# EAGLE design teensy_cfd (EAGLE 9.6.2)
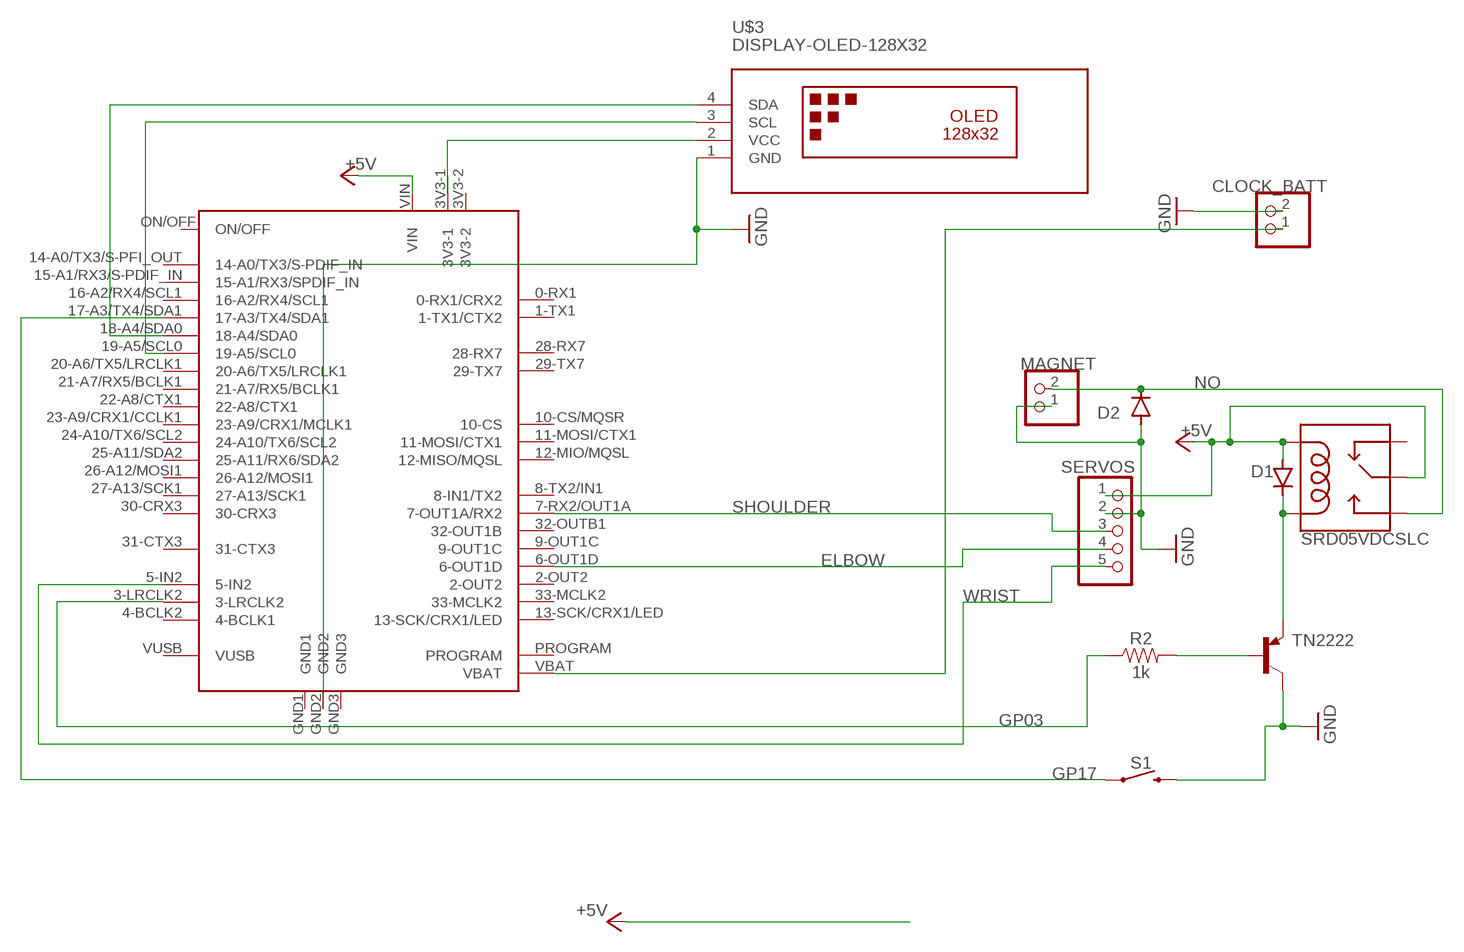
[diagram p0: schematic, sheet 1]

## Parts
CLOCK_BATT  PINHD-1X2  [1X02]
D1  1N4004  [DO41-10]
D2  1N4004  [DO41-10]
MAGNET  PINHD-1X2  [1X02]
R2  1k  1KOHM-HORIZ-1/4W-1%  [AXIAL-0.3]
S1  MOMENTARY-SWITCH-SPST-PTH-6.0MM  [TACTILE_SWITCH_PTH_6.0MM]
SERVOS  PINHD-1X5  [1X05]
SRD05VDCSLC  RELAYPTH  [SRD-05VDC-SL-C]
TN2222  TN2222  PNP_TO92  [TO92]
U$1  TEENSY40  [TEENSY40]
U$3  DISPLAY-OLED-128X32  [DISPLAY-OLED-128X32]

## Nets
+5V: D1.A SERVOS.1 SRD05VDCSLC.COIL1 SRD05VDCSLC.SWCOMMON U$1.VIN
ELBOW: SERVOS.4 U$1.6-OUT1D
GND: CLOCK_BATT.2 D2.A MAGNET.1 S1.3 SERVOS.2 TN2222.1(C) U$1.GND2 U$3.1(GND)
GP03: R2.P$1 U$1.3-LRCLK2
GP17: S1.1 U$1.17-A3/TX4/SDA1
N$1: R2.P$2 TN2222.2(B)
N$2: D1.C SRD05VDCSLC.COIL0 TN2222.3(E)
N$3: CLOCK_BATT.1 U$1.VBAT
N$5: U$1.18-A4/SDA0 U$3.4(SDA)
N$6: U$1.19-A5/SCL0 U$3.3(SCL)
N$7: U$1.3V3-1 U$3.2(VCC)
NO: D2.C MAGNET.2 SRD05VDCSLC.SWOPEN
SHOULDER: SERVOS.3 U$1.7-RX2/OUT1A(7-OUT1A/RX2)
WRIST: SERVOS.5 U$1.5-IN2
Unconnected: SRD05VDCSLC.SWCLOSED(SWCLOSE) U$1.0-RX1(0-RX1/CRX2) U$1.1-TX1(1-TX1/CTX2) U$1.2-OUT2 U$1.3V3-2 U$1.4-BCLK2(4-BCLK1) U$1.8-TX2/IN1(8-IN1/TX2) U$1.9-OUT1C U$1.10-CS/MQSR(10-CS) U$1.11-MOSI/CTX1 U$1.12-MIO/MQSL(12-MISO/MQSL) U$1.13-SCK/CRX1/LED U$1.14-A0/TX3/S-PFI_OUT(14-A0/TX3/S-PDIF_IN) U$1.15-A1/RX3/S-PDIF_IN(15-A1/RX3/SPDIF_IN) U$1.16-A2/RX4/SCL1 U$1.20-A6/TX5/LRCLK1 U$1.21-A7/RX5/BCLK1 U$1.22-A8/CTX1 U$1.23-A9/CRX1/CCLK1(23-A9/CRX1/MCLK1) U$1.24-A10/TX6/SCL2 U$1.25-A11/SDA2(25-A11/RX6/SDA2) U$1.26-A12/MOSI1 U$1.27-A13/SCK1 U$1.28-RX7 U$1.29-TX7 U$1.30-CRX3 U$1.31-CTX3 U$1.32-OUTB1(32-OUT1B) U$1.33-MCLK2 U$1.GND1 U$1.GND3 U$1.ON/OFF U$1.PROGRAM U$1.VUSB

## Library data of the parts
CLOCK_BATT MAGNET = pinhead:PINHD-1X2: PIN HEADER
D1 D2 = diode:1N4004: DIODE general purpose rectifier, 1 A
R2 = SparkFun-Resistors:1KOHM: 1kΩ resistor A resistor is a passive two-terminal electrical component that implements electrical resistance as a circuit element. Resistors act to reduce current flow, and, at the same time, act to lower voltage levels within circuits. - Wikipedia; PROD_ID: RES-12182
S1 = SparkFun-Switches:MOMENTARY-SWITCH-SPST: Momentary Switch (Pushbutton) - SPST Normally-open (NO) SPST momentary switches (buttons, pushbuttons). Variants PTH-12MM - 12mm square, through-hole Momentary Pushbutton Switch - 12mm Square <https://www.sparkfun.com/products/9190> (COM-09190) PTH-6.0MM, PTH-6.0MM-KIT - 6.0mm square, through-hole Mini Pushbutton Switch <https://www.sparkfun.com/products/97> (COM-00097) KIT package intended for soldering kit's - only one side of pads' copper is exposed. PTH-RIGHT-ANGLE-KIT - Right-angle, through-hole Right Angle Tactile Button <https://www.sparkfun.com/products/10791> - Used on SparkFun BigTime Watch Kit <https://www.sparkfun.com/products/11734> SMD-12MM - 12mm square, surface-mount Tactile Button - SMD (12mm) <https://www.sparkfun.com/products/12993> (COM-12993) Used on SparkFun PicoBoard <https://www.sparkfun.com/products/11888> SMD-4.5MM - 4.5mm Square Trackball Switch Used on SparkFun Blackberry Trackballer Breakout <https://www.sparkfun.com/products/13169> SMD-4.6MMX2.8MM - 4.60mm x 2.80mm, surface mount Used on SparkFun SAMD21 Mini Breakout <https://www.sparkfun.com/products/13664> SMD-5.2MM, SMD-5.2-REDUNDANT - 5.2mm square, surface-mount Mini Pushbutton Switch - SMD <https://www.sparkfun.com/products/8720> (COM-08720) Used on Arduino Pro Mini <https://www.sparkfun.com/products/11114> REDUNDANT package connects both switch circuits together SMD-6.0X3.5MM - 6.0 x 3.5mm, surface mount Momentary Reset Switch SMD <https://www.sparkfun.com/products/8229> (COM-08229) SMD-6.2MM-TALL - 6.2mm square, surface mount Tactile Button - SMD (6mm) <https://www.sparkfun.com/products/12992> Used on SparkFun Digital Sandbox <https://www.sparkfun.com/products/12651> SMD-RIGHT-ANGLE - Right-angle, surface mount Used on SparkFun Block for Intel® Edison - Arduino <https://www.sparkfun.com/products/13036>; PROD_ID: SWCH-08441; SF_SKU: COM-00097
SERVOS = pinhead:PINHD-1X5: PIN HEADER
SRD05VDCSLC = SRD-05VDC-SL-C:RELAY: SPDT relay (COM-00101)
TN2222 = Transistor:PNP: PNP - Generic; CATEGORY: Transistor; SUB-CATEGORY: BJT; TYPE: PNP; VALUE: PNP
U$1 = teensy:TEENSY40: Teensy 4.0 device including POGO pins for pins 24 - 33, but not yet pins for D+ and D-. Symbol layout is what works for me and may not suite everyone... that can be added or additional symbols can be created to be used in a modilied davie name.
U$3 = diy-modules (1):DISPLAY-OLED-128X32: 128x32 Dot Matrix OLED Module with I2C interface based on SSD1306 chip More details available here: http://www.tinyosshop.com/index.php?route=product/product&product_id=953 Schematic available here: http://www.tinyosshop.com/datasheet/OLED%2012832.pdf SSD1306 datasheet: https://cdn-shop.adafruit.com/datasheets/SSD1306.pdf Click here to find device on ebay.com <http://www.ebay.com/sch/oled+display+128x32+i2c>

## Board
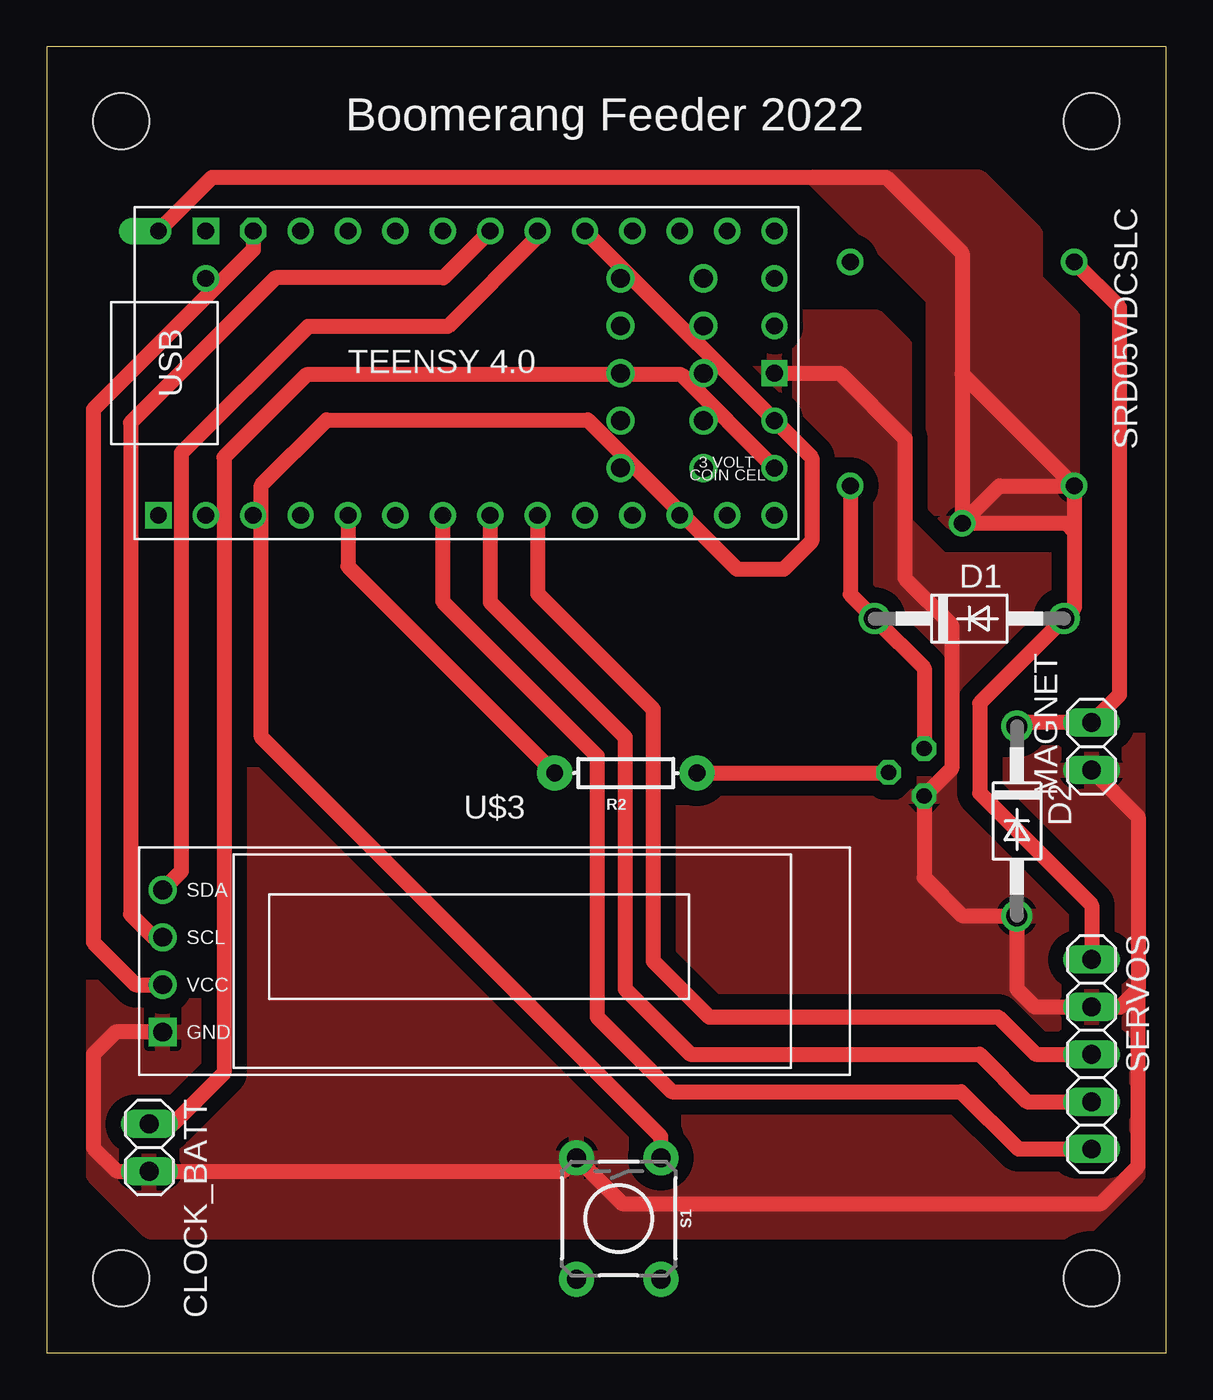
[diagram p1: board, top side]
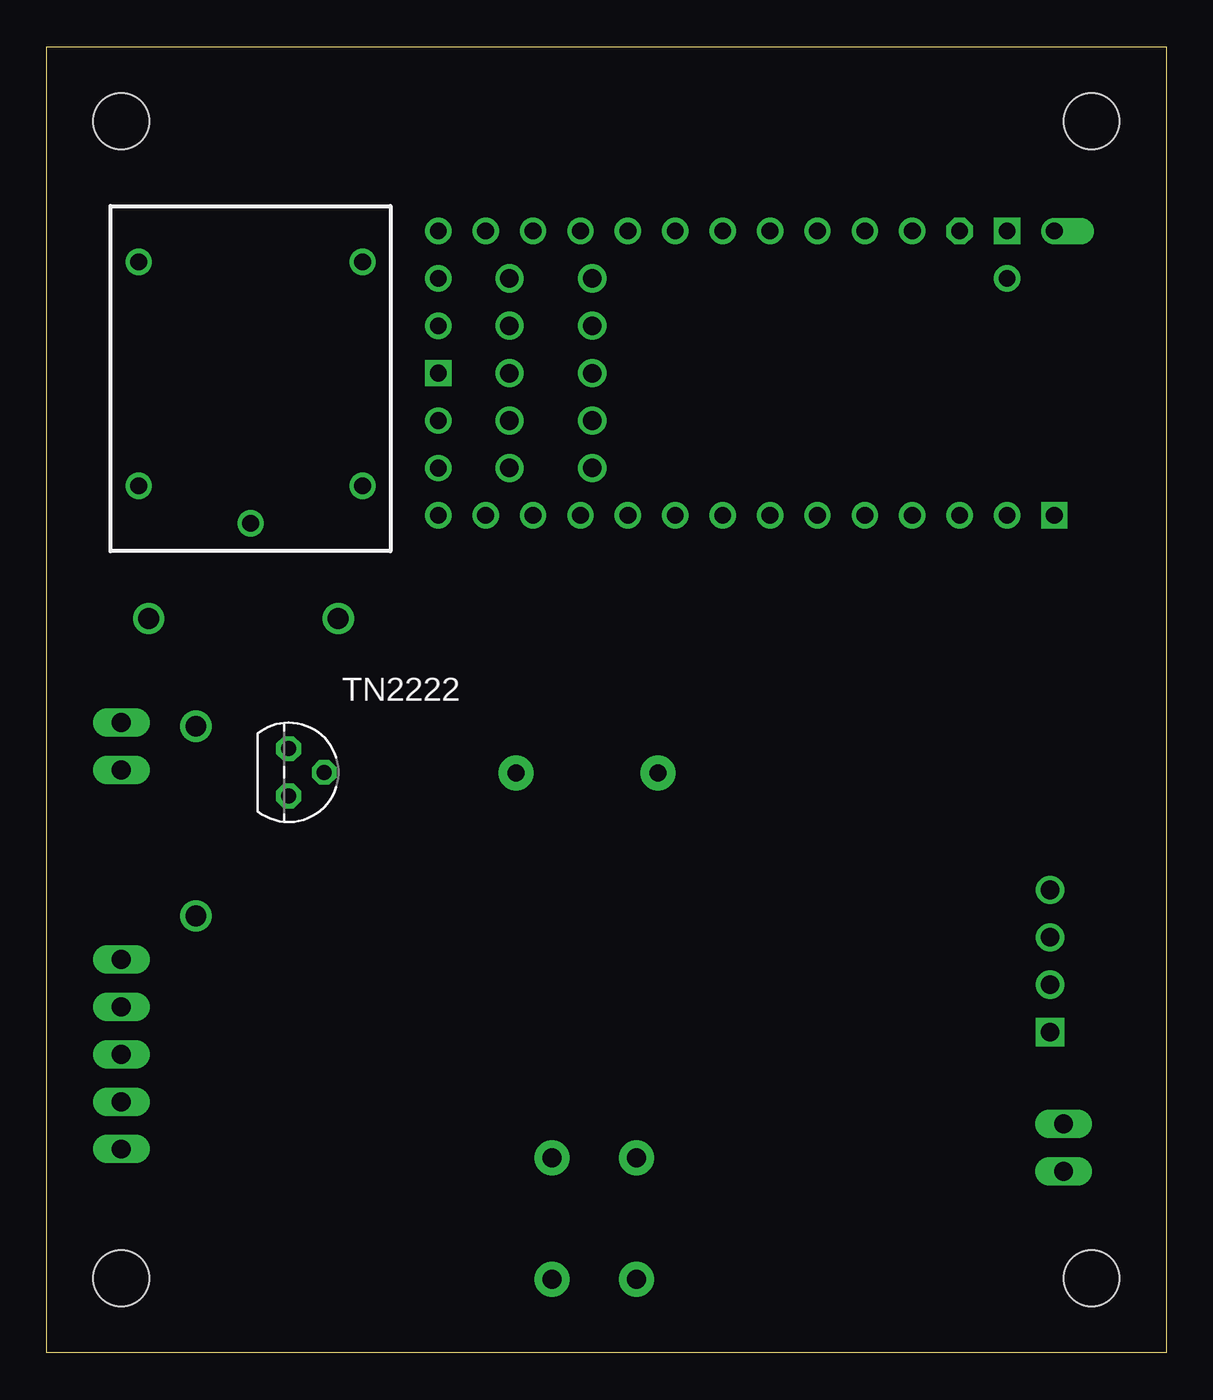
[diagram p2: board, bottom side, seen from below]

Size 60 x 70 mm. Coordinates in mm from the lower left corner, seen from the top.
Outline: 0,0 60,0 60,70 0,70 0,0
Copper layers (1*16): Top 0.035mm / dielectric 1.5mm / Bottom 0.035mm
Design rules "default": minimum track width 6mil, minimum drill 0.35mm, track to track 6mil, track to pad 6mil, pad to pad 6mil, via to via 6mil, smd to smd 6mil, copper to edge 40mil, drill to drill 6mil, minimum pad ring 10mil, minimum via ring 8mil, stop-mask expansion 4mil, vias tented up to drill 0mil, thermal gap 10mil
Holes 3 mm at 4,4 4,66 56,66 56,4

### Footprints (pad centres in the part's own frame; a part is rotated, then mirrored left to right if it is on the bottom)
1X02 = drill 1.016 long: 1 -1.27,0; 2 1.27,0
DO41-10 = drill 1.118: A 5.08,0; C -5.08,0
AXIAL-0.3 = drill 0.9 pad 1.88: P$1 -3.81,0; P$2 3.81,0
TACTILE_SWITCH_PTH_6.0MM = drill 1.016 pad 1.88: 1 -3.251,2.261; 2 3.251,2.261; 3 -3.251,-2.261; 4 3.251,-2.261
1X05 = drill 1.016 long: 1 -5.08,0; 2 -2.54,0; 3 0,0; 4 2.54,0; 5 5.08,0
SRD-05VDC-SL-C = drill 0.9: COIL0 -5.39,-6.12; COIL1 -5.39,5.88; SWCLOSED 6.61,-6.12; SWCOMMON -7.39,-0.12; SWOPEN 6.61,5.88
TO92 = drill 0.813 octagon: 1 1.27,0; 2 0,1.905; 3 -1.27,0
TEENSY40 = drill 0.9: 0-RX1 -13.97,-7.62; 1-TX1 -11.43,-7.62; 2-OUT2 -8.89,-7.62; 3-LRCLK2 -6.35,-7.62; 3V3-2 16.51,-2.54; 4-BCLK2 -3.81,-7.62; 5-IN2 -1.27,-7.62; 6-OUT1D 1.27,-7.62; 7-RX2/OUT1A 3.81,-7.62; 8-TX2/IN1 6.35,-7.62; 9-OUT1C 8.89,-7.62; 10-CS/MQSR 11.43,-7.62; 11-MOSI/CTX1 13.97,-7.62; 12-MIO/MQSL 16.51,-7.62; 13-SCK/CRX1/LED 16.51,7.62; 14-A0/TX3/S-PFI_OUT 13.97,7.62; 15-A1/RX3/S-PDIF_IN 11.43,7.62; 16-A2/RX4/SCL1 8.89,7.62; 17-A3/TX4/SDA1 6.35,7.62; 18-A4/SDA0 3.81,7.62; 19-A5/SCL0 1.27,7.62; 20-A6/TX5/LRCLK1 -1.27,7.62; 21-A7/RX5/BCLK1 -3.81,7.62; 22-A8/CTX1 -6.35,7.62; 23-A9/CRX1/CCLK1 -8.89,7.62; ON/OFF 16.51,5.08; PROGRAM 16.51,2.54; VBAT 16.51,-5.08; VUSB -13.97,5.08 | drill 0.9 octagon: 3V3-1 -11.43,7.62 | drill 1: 24-A10/TX6/SCL2 12.7,5.08; 25-A11/SDA2 8.255,5.08; 26-A12/MOSI1 12.7,2.54; 27-A13/SCK1 8.255,2.54; 28-RX7 12.7,0; 29-TX7 8.255,0; 30-CRX3 12.7,-2.54; 31-CTX3 8.255,-2.54; 32-OUTB1 12.7,-5.08; 33-MCLK2 8.255,-5.08 | drill 0.9 square: GND1 -16.51,-7.62; GND2 16.51,0; GND3 -13.97,7.62 | drill 0.9 offset: VIN -16.51,7.62
DISPLAY-OLED-128X32 = drill 1 square: 1 -17.78,-3.81 | drill 1: 2 -17.78,-1.27; 3 -17.78,1.27; 4 -17.78,3.81

### Placement (x,y rotation side)
CLOCK_BATT  5.5,11 270 top
D1  49.45,39.35 0 top
D2  52,28.5 270 top
MAGNET  56,32.5 90 top
R2  31.04,31.07 0 top
S1  30.66,7.2 270 top
SERVOS  56,16 270 top
SRD05VDCSLC  49.19,51.85 90 bottom
TN2222  47.03,31.11 270 bottom
U$1  22.5,52.5 0 top
U$3  24,21 0 top

### Tracks (layer width: path | path; a pad name or v marks a point on that pad's centre or on a via)
+5V
  Top 0.813: SRD05VDCSLC.SWCOMMON 51.07,46.46 SRD05VDCSLC.COIL1 | SRD05VDCSLC.COIL1 55.07,44 | 55.07,44 55.07,39.89 D1.A 50,34.82 50,30 56,24 SERVOS.1 | U$1.VIN 8.87,63 45,63 49.07,58.93 49.07,52.46 | 49.07,52.46 SRD05VDCSLC.SWCOMMON | SRD05VDCSLC.COIL1 49.07,52.46 | SRD05VDCSLC.SWCOMMON 54.61,44.46 55.07,44
  pour Top (isolate 0.813): 49,44.5 55,44.5 55,46.5 55,55.5 53,57.5 53,60 50,63 41,63 47.5,56.5 47.5,47 47.5,45.5 48.5,44.5
ELBOW
  Top 0.813: U$1.6-OUT1D 23.77,40.23 31,33 31,19.5 34.5,16 50,16 52.54,13.46 SERVOS.4
GND
  Top 0.813: U$3.1 3.69,17.19 2.5,16 2.5,11 3.77,9.73 CLOCK_BATT.2 27.68,9.73 S1.3 30.85,8 56.5,8 58.5,10 58.5,19.5 | MAGNET.1 58.5,28.73 58.5,19.5 | 58.5,19.5 57.54,18.54 SERVOS.2 52.96,18.54 52,19.5 D2.A 49.08,23.42 47.03,25.47 TN2222.1 48.5,31.31 48.5,39 46,41.5 46,49 42.5,52.5 U$1.GND2
  pour Top (isolate 0.813): 46,49 46,54 44.5,55.5 7.5,55.5 2.5,50.5 2.5,9.5 5.5,6.5 55.5,6.5 58.5,9.5 58.5,38 55.5,41 54,42.5 48,42.5 46,44.5
GP03
  Top 0.813: U$1.3-LRCLK2 16.15,42.15 R2.P$1
GP17
  Top 0.813: U$1.17-A3/TX4/SDA1 41,47.97 41,43.5 39.5,42 37,42 29,50 15,50 11.5,46.5 11.5,33 32.92,11.58 S1.1
N$1
  Top 0.813: R2.P$2 45.09,31.07 TN2222.2
N$2
  Top 0.813: SRD05VDCSLC.COIL0 43.07,40.65 D1.C 47.03,36.69 TN2222.3
N$3
  Top 0.813: U$1.VBAT 34.01,52.42 13.92,52.42 9.5,48 9.5,15 6.77,12.27 CLOCK_BATT.1
N$5
  Top 0.813: U$1.18-A4/SDA0 26.31,59.81 21.5,55 14,55 7.22,48.22 7.22,25.81 U$3.4
N$6
  Top 0.813: U$1.19-A5/SCL0 21.27,57.62 12.27,57.62 4.5,49.85 4.5,23.5 5.73,22.27 U$3.3
N$7
  Top 0.813: U$1.3V3-1 11.07,59.12 2.5,50.55 2.5,22 4.77,19.73 U$3.2
NO
  Top 0.813: D2.C 52.19,33.77 MAGNET.2 57.5,35.27 57.5,56.03 SRD05VDCSLC.SWOPEN
SHOULDER
  Top 0.813: U$1.7-RX2/OUT1A 26.31,40.69 32.5,34.5 32.5,21 35.5,18 51,18 53,16 SERVOS.3
WRIST
  Top 0.813: U$1.5-IN2 21.23,40.27 29.5,32 29.5,18 33.5,14 49,14 52.08,10.92 SERVOS.5

### Text on the board
tNames: Boomerang Feeder 2022